# EAGLE schematic sensing (EAGLE 7.4.0)
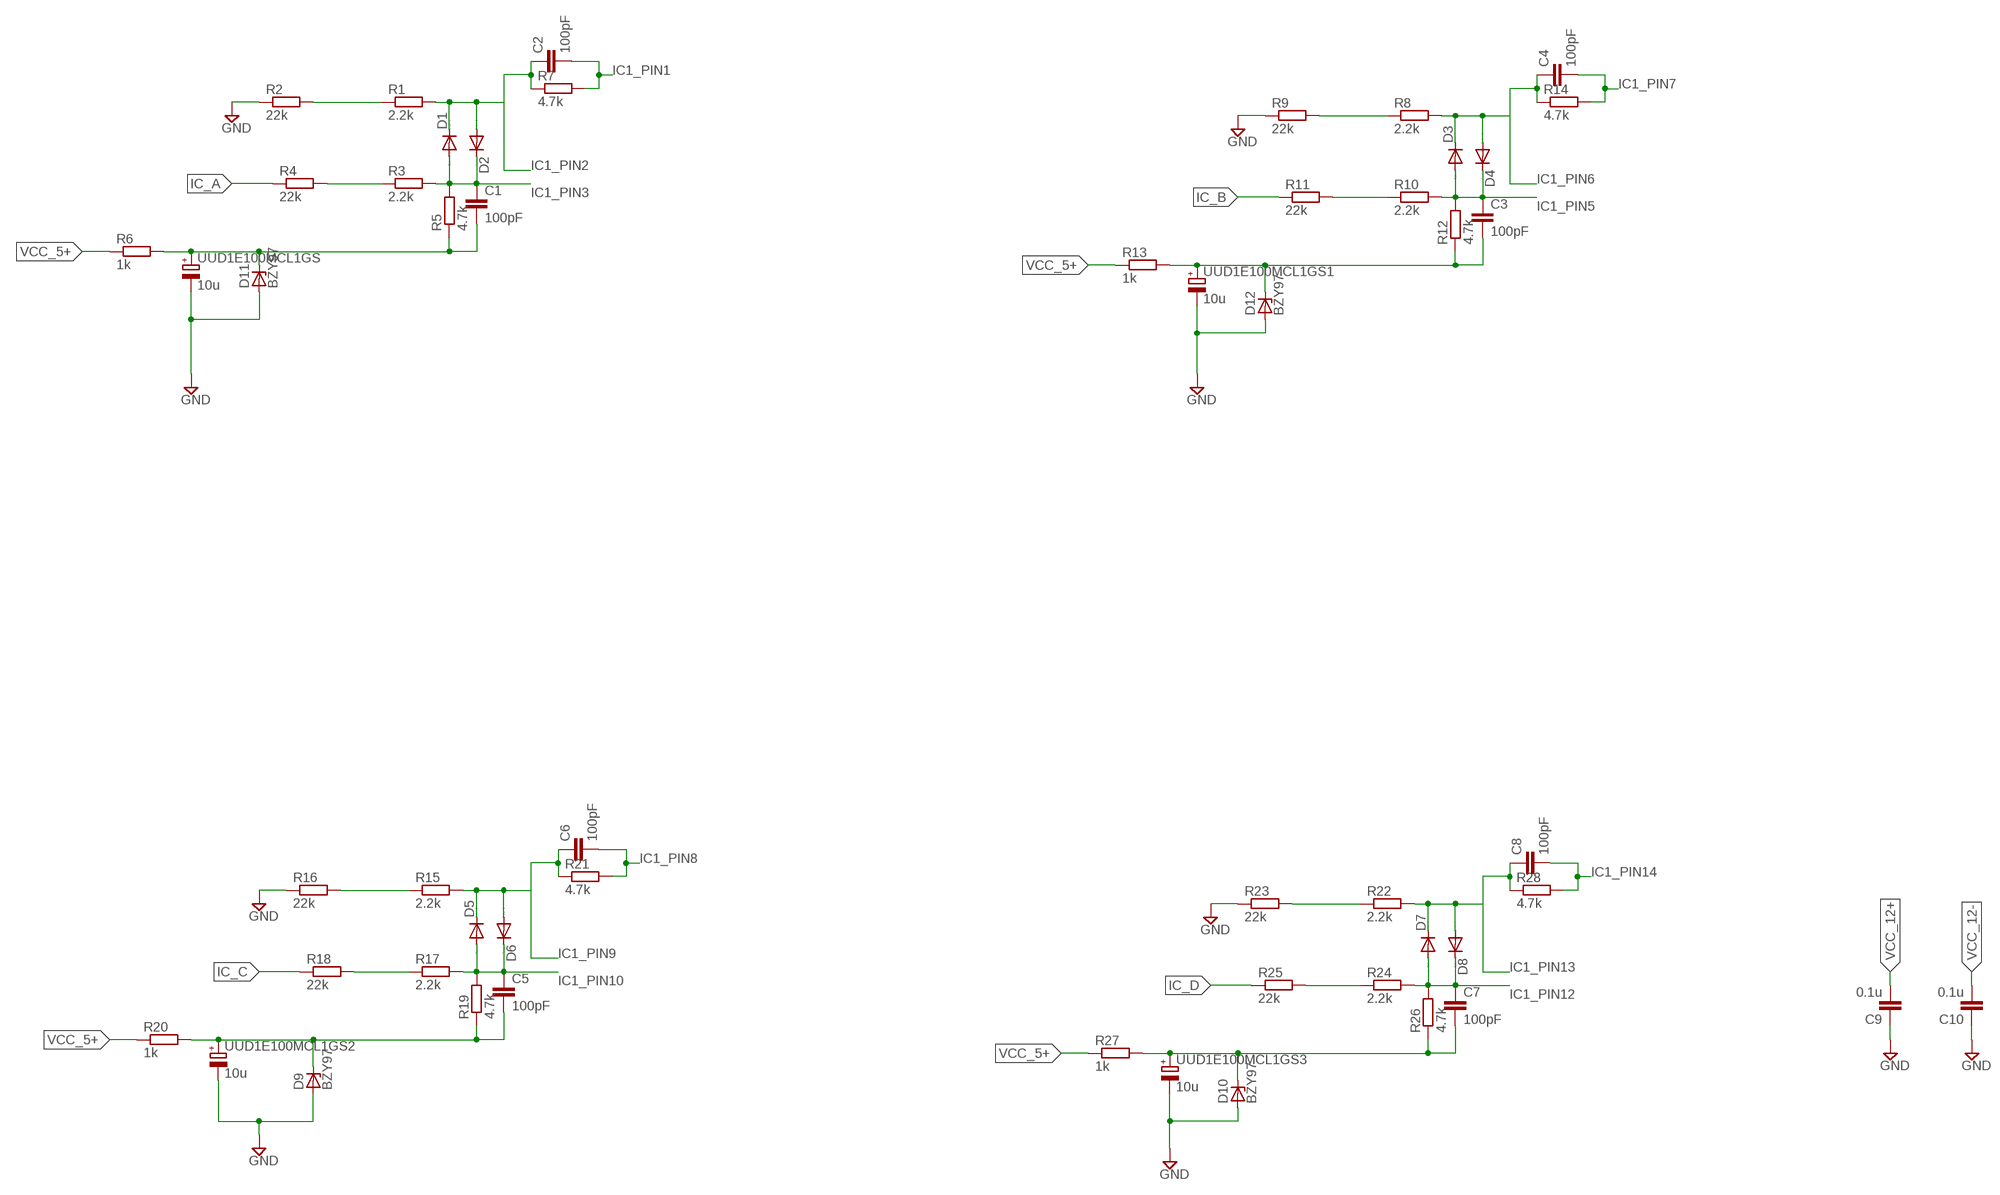
[diagram p0: schematic, sheet 1, part 1 of 3]
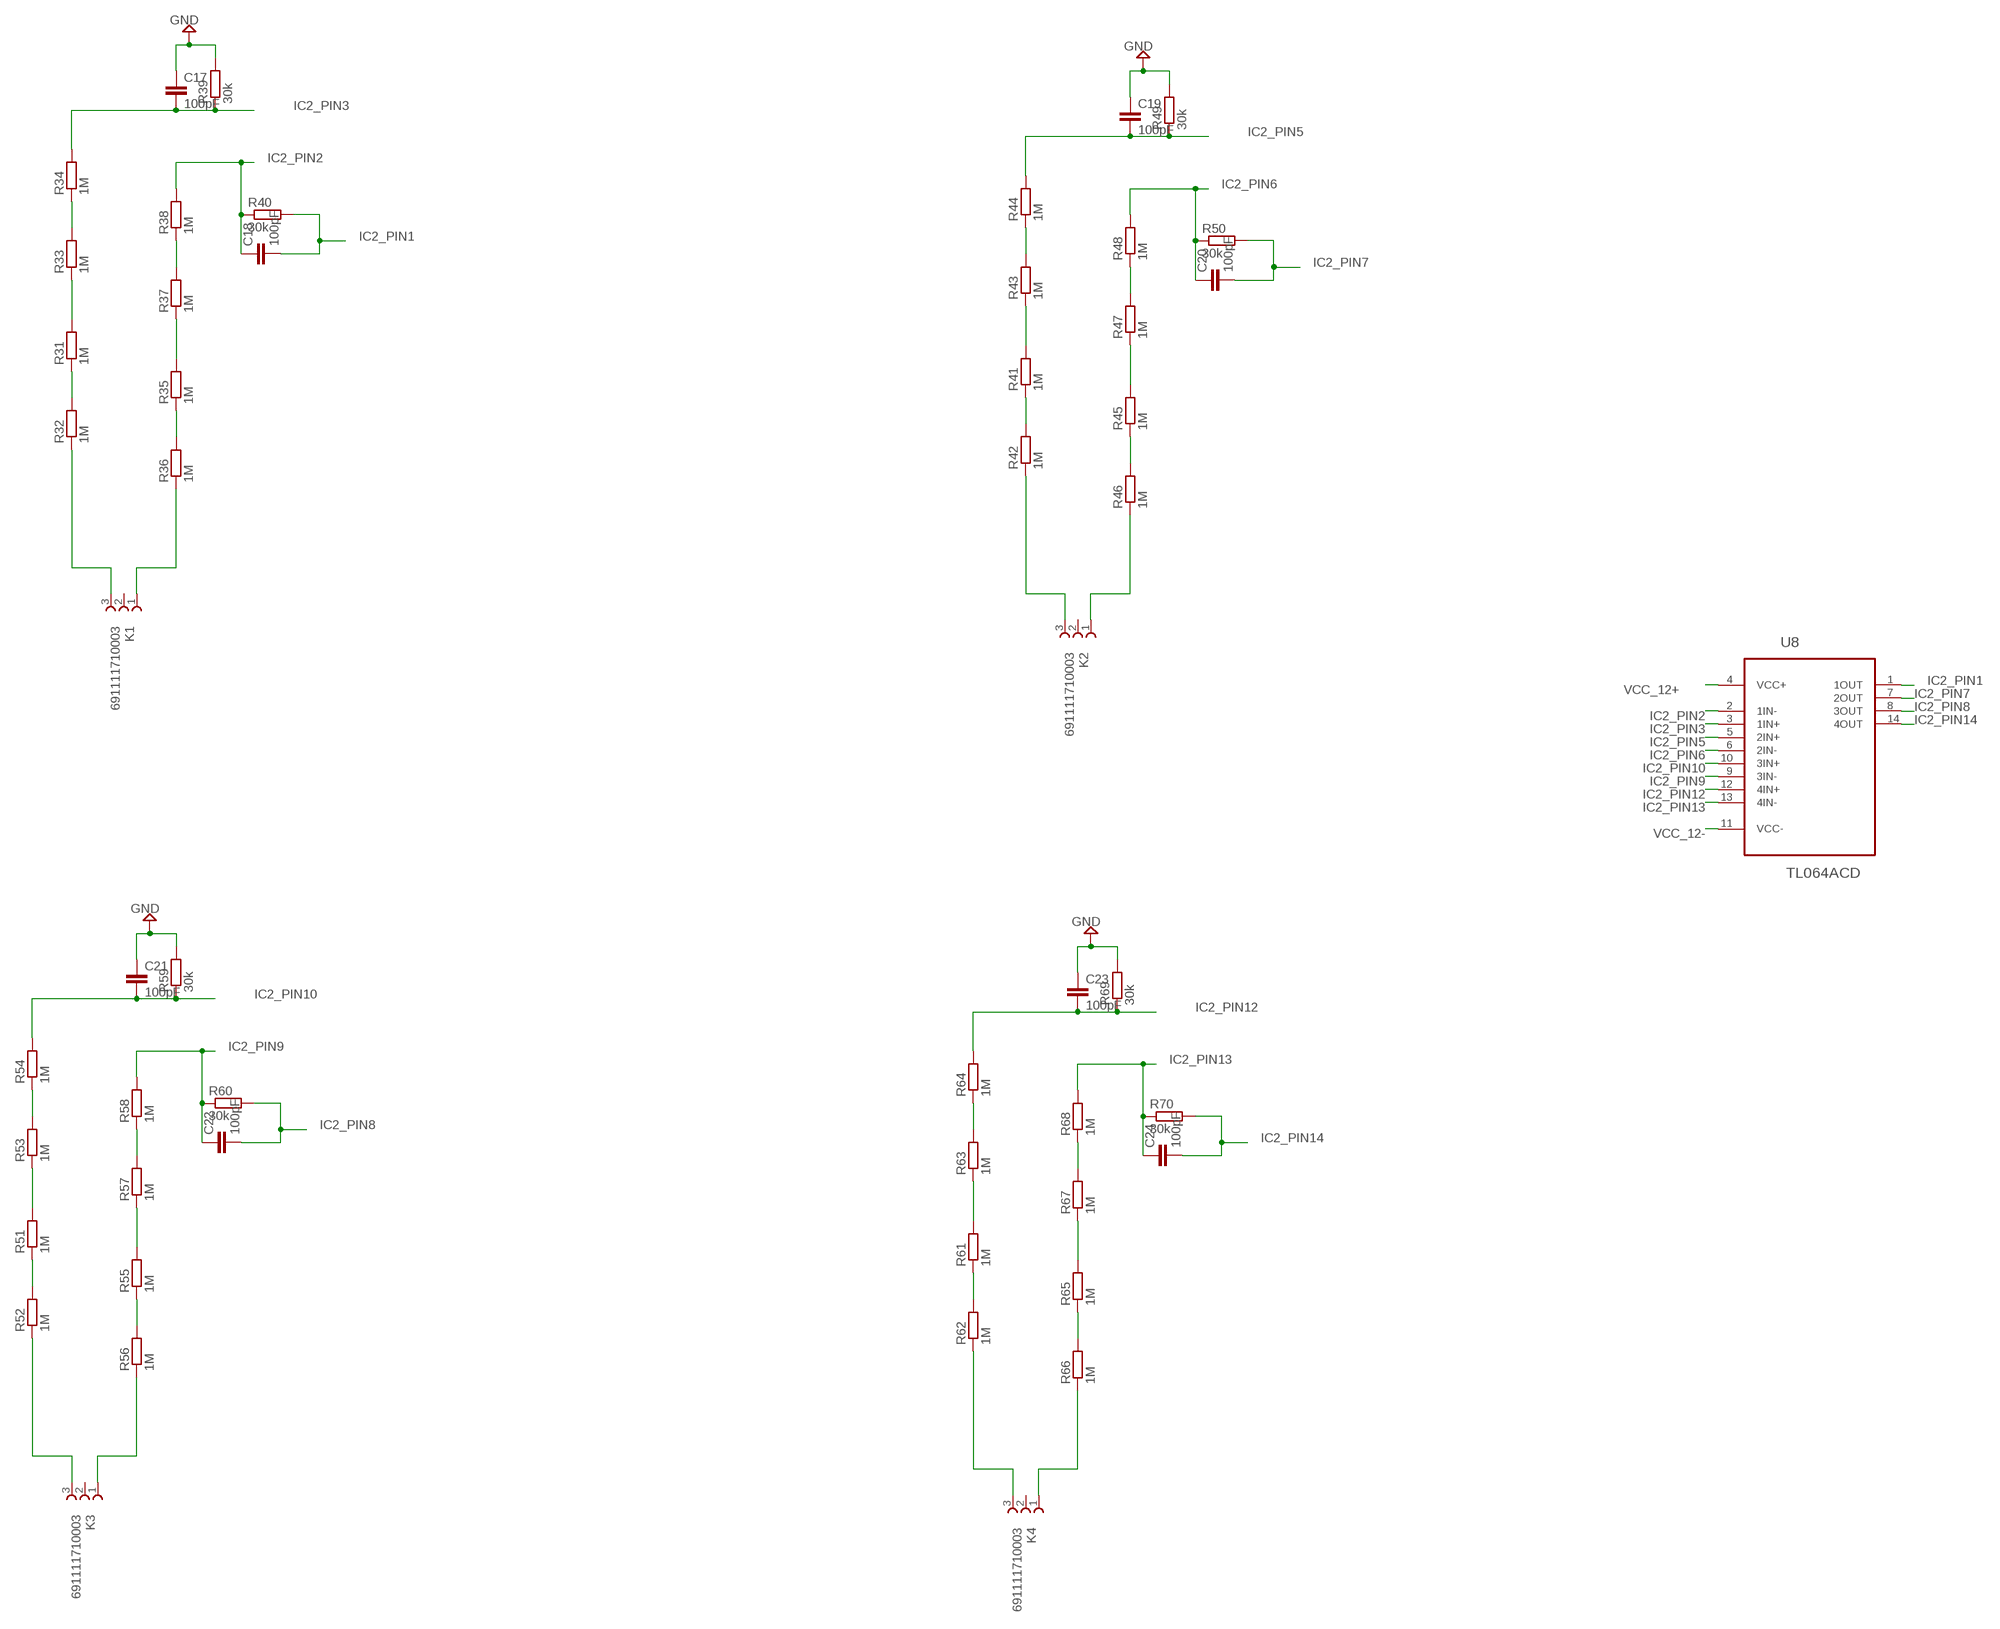
[diagram p1: schematic, sheet 1, part 2 of 3]
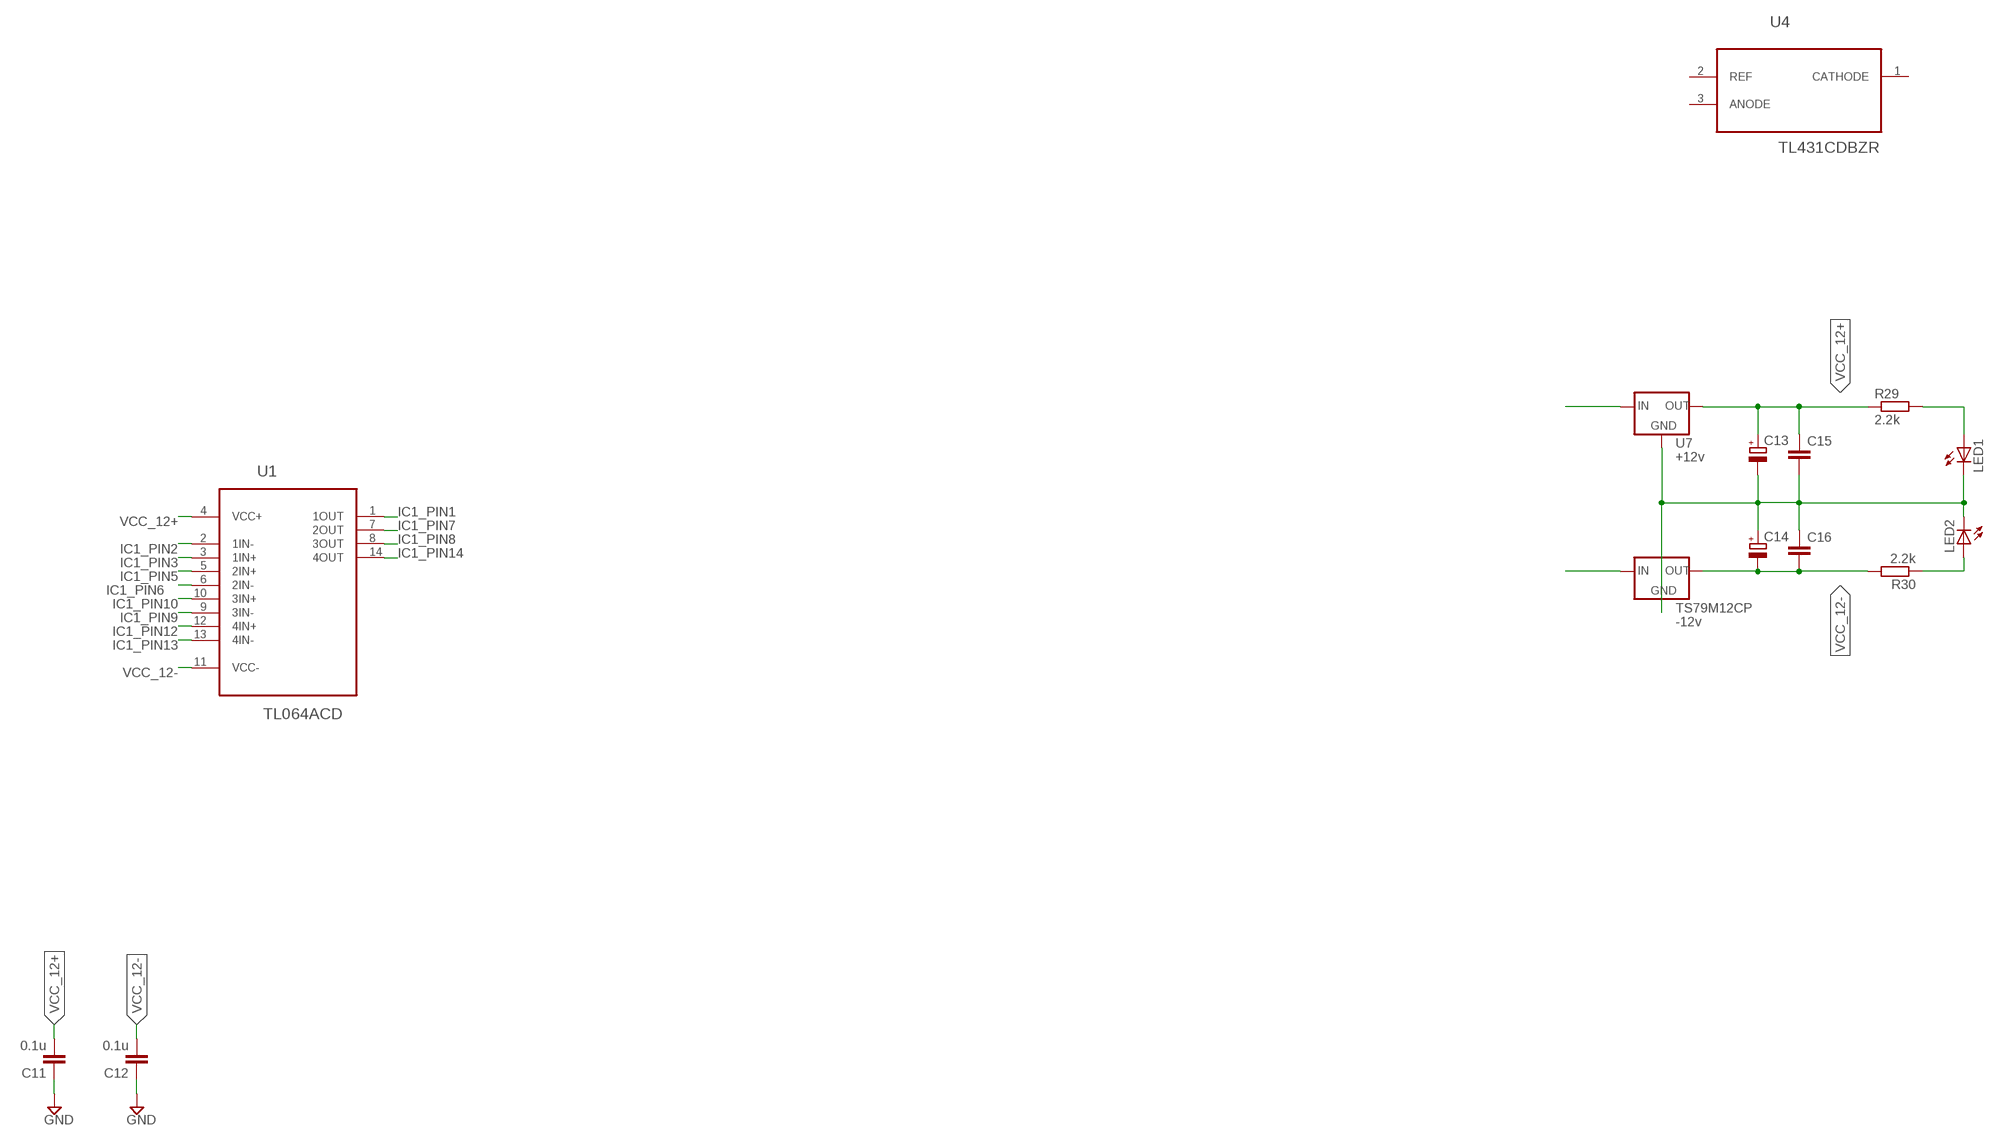
[diagram p2: schematic, sheet 1, part 3 of 3]

## Parts
C1  100pF  C-EUC0402K  [C0402K]
C2  100pF  C-EUC0402K  [C0402K]
C3  100pF  C-EUC0402K  [C0402K]
C4  100pF  C-EUC0402K  [C0402K]
C5  100pF  C-EUC0402K  [C0402K]
C6  100pF  C-EUC0402K  [C0402K]
C7  100pF  C-EUC0402K  [C0402K]
C8  100pF  C-EUC0402K  [C0402K]
C9  0.1u  C-EUC0603K  [C0603K]
C10  0.1u  C-EUC0603K  [C0603K]
C11  0.1u  C-EUC0603K  [C0603K]
C12  0.1u  C-EUC0603K  [C0603K]
C13  CPOL-EU150CLZ-1014  [150CLZ-1014]
C14  CPOL-EU150CLZ-1014  [150CLZ-1014]
C15  C-EUC1206  [C1206]
C16  C-EUC1206  [C1206]
C17  100pF  C-EUC0402K  [C0402K]
C18  100pF  C-EUC0402K  [C0402K]
C19  100pF  C-EUC0402K  [C0402K]
C20  100pF  C-EUC0402K  [C0402K]
C21  100pF  C-EUC0402K  [C0402K]
C22  100pF  C-EUC0402K  [C0402K]
C23  100pF  C-EUC0402K  [C0402K]
C24  100pF  C-EUC0402K  [C0402K]
D1  DIODE-DO41-10  [DO41-10]
D2  DIODE-DO41-10  [DO41-10]
D3  DIODE-DO41-10  [DO41-10]
D4  DIODE-DO41-10  [DO41-10]
D5  DIODE-DO41-10  [DO41-10]
D6  DIODE-DO41-10  [DO41-10]
D7  DIODE-DO41-10  [DO41-10]
D8  DIODE-DO41-10  [DO41-10]
D9  BZY97  [F126Z12]
D10  BZY97  [F126Z12]
D11  BZY97  [F126Z12]
D12  BZY97  [F126Z12]
K1  691111710003  [691111710003]
K2  691111710003  [691111710003]
K3  691111710003  [691111710003]
K4  691111710003  [691111710003]
LED1  LED3MM  [LED3MM]
LED2  LED3MM  [LED3MM]
R1  2.2k  R-EU_0207/10  [0207/10]
R2  22k  R-EU_0207/10  [0207/10]
R3  2.2k  R-EU_0207/10  [0207/10]
R4  22k  R-EU_0207/10  [0207/10]
R5  4.7k  R-EU_0207/10  [0207/10]
R6  1k  R-EU_0207/10  [0207/10]
R7  4.7k  R-EU_0207/10  [0207/10]
R8  2.2k  R-EU_0207/10  [0207/10]
R9  22k  R-EU_0207/10  [0207/10]
R10  2.2k  R-EU_0207/10  [0207/10]
R11  22k  R-EU_0207/10  [0207/10]
R12  4.7k  R-EU_0207/10  [0207/10]
R13  1k  R-EU_0207/10  [0207/10]
R14  4.7k  R-EU_0207/10  [0207/10]
R15  2.2k  R-EU_0207/10  [0207/10]
R16  22k  R-EU_0207/10  [0207/10]
R17  2.2k  R-EU_0207/10  [0207/10]
R18  22k  R-EU_0207/10  [0207/10]
R19  4.7k  R-EU_0207/10  [0207/10]
R20  1k  R-EU_0207/10  [0207/10]
R21  4.7k  R-EU_0207/10  [0207/10]
R22  2.2k  R-EU_0207/10  [0207/10]
R23  22k  R-EU_0207/10  [0207/10]
R24  2.2k  R-EU_0207/10  [0207/10]
R25  22k  R-EU_0207/10  [0207/10]
R26  4.7k  R-EU_0207/10  [0207/10]
R27  1k  R-EU_0207/10  [0207/10]
R28  4.7k  R-EU_0207/10  [0207/10]
R29  2.2k  R-EU_0207/10  [0207/10]
R30  2.2k  R-EU_0207/10  [0207/10]
R31  1M  R-EU_0207/10  [0207/10]
R32  1M  R-EU_0207/10  [0207/10]
R33  1M  R-EU_0207/12  [0207/12]
R34  1M  R-EU_0207/10  [0207/10]
R35  1M  R-EU_0207/10  [0207/10]
R36  1M  R-EU_0207/10  [0207/10]
R37  1M  R-EU_0207/10  [0207/10]
R38  1M  R-EU_0207/10  [0207/10]
R39  30k  R-EU_0207/10  [0207/10]
R40  30k  R-EU_0207/10  [0207/10]
R41  1M  R-EU_0207/10  [0207/10]
R42  1M  R-EU_0207/10  [0207/10]
R43  1M  R-EU_0207/10  [0207/10]
R44  1M  R-EU_0207/10  [0207/10]
R45  1M  R-EU_0207/10  [0207/10]
R46  1M  R-EU_0207/10  [0207/10]
R47  1M  R-EU_0207/10  [0207/10]
R48  1M  R-EU_0207/10  [0207/10]
R49  30k  R-EU_0207/10  [0207/10]
R50  30k  R-EU_0207/10  [0207/10]
R51  1M  R-EU_0207/10  [0207/10]
R52  1M  R-EU_0207/10  [0207/10]
R53  1M  R-EU_0207/10  [0207/10]
R54  1M  R-EU_0207/10  [0207/10]
R55  1M  R-EU_0207/10  [0207/10]
R56  1M  R-EU_0207/10  [0207/10]
R57  1M  R-EU_0207/10  [0207/10]
R58  1M  R-EU_0207/10  [0207/10]
R59  30k  R-EU_0207/10  [0207/10]
R60  30k  R-EU_0207/10  [0207/10]
R61  1M  R-EU_0207/10  [0207/10]
R62  1M  R-EU_0207/10  [0207/10]
R63  1M  R-EU_0207/10  [0207/10]
R64  1M  R-EU_0207/10  [0207/10]
R65  1M  R-EU_0207/10  [0207/10]
R66  1M  R-EU_0207/10  [0207/10]
R67  1M  R-EU_0207/10  [0207/10]
R68  1M  R-EU_0207/10  [0207/10]
R69  30k  R-EU_0207/10  [0207/10]
R70  30k  R-EU_0207/10  [0207/10]
TS79M12CP  -12v  V_REG_78XX7912  [TO-252]
U1  TL064ACD  [SOIC127P600X175-14N]
U4  TL431CDBZR  [SOT95P237X112-3N]
U7  +12v  V_REG_78XX7812  [TO-252]
U8  TL064ACD  [SOIC127P600X175-14N]
UUD1E100MCL1GS  10u  CPOL-EU153CLV-0405  [153CLV-0405]
UUD1E100MCL1GS1  10u  CPOL-EU153CLV-0405  [153CLV-0405]
UUD1E100MCL1GS2  10u  CPOL-EU153CLV-0405  [153CLV-0405]
UUD1E100MCL1GS3  10u  CPOL-EU153CLV-0405  [153CLV-0405]

## Nets
GND: C9.1 C10.1 C11.1 C12.1 C17.1 C19.1 C21.1 C23.1 D9.A D10.A D11.A D12.A R2.1 R9.1 R16.1 R23.1 R39.2 R49.2 R59.2 R69.2 UUD1E100MCL1GS1.- UUD1E100MCL1GS2.- UUD1E100MCL1GS3.- UUD1E100MCL1GS.-
IC1_PIN1: C2.2 R7.2 U1.1(1OUT)
IC1_PIN2: C2.1 D1.C D2.A R1.2 R7.1 U1.2(1IN-)
IC1_PIN3: C1.1 D1.A D2.C R3.2 R5.2 U1.3(1IN+)
IC1_PIN5: C3.1 D3.A D4.C R10.2 R12.2 U1.5(2IN+)
IC1_PIN6: C4.1 D3.C D4.A R8.2 R14.1 U1.6(2IN-)
IC1_PIN7: C4.2 R14.2 U1.7(2OUT)
IC1_PIN8: C6.2 R21.2 U1.8(3OUT)
IC1_PIN9: C6.1 D5.C D6.A R15.2 R21.1 U1.9(3IN-)
IC1_PIN10: C5.1 D5.A D6.C R17.2 R19.2 U1.10(3IN+)
IC1_PIN12: C7.1 D7.A D8.C R24.2 R26.2 U1.12(4IN+)
IC1_PIN13: C8.1 D7.C D8.A R22.2 R28.1 U1.13(4IN-)
IC1_PIN14: C8.2 R28.2 U1.14(4OUT)
IC2_PIN1: C18.2 R40.2 U8.1(1OUT)
IC2_PIN2: C18.1 R38.2 R40.1 U8.2(1IN-)
IC2_PIN3: C17.2 R34.2 R39.1 U8.3(1IN+)
IC2_PIN5: C19.2 R44.2 R49.1 U8.5(2IN+)
IC2_PIN6: C20.1 R48.2 R50.1 U8.6(2IN-)
IC2_PIN7: C20.2 R50.2 U8.7(2OUT)
IC2_PIN8: C22.2 R60.2 U8.8(3OUT)
IC2_PIN9: C22.1 R58.2 R60.1 U8.9(3IN-)
IC2_PIN10: C21.2 R54.2 R59.1 U8.10(3IN+)
IC2_PIN12: C23.2 R64.2 R69.1 U8.12(4IN+)
IC2_PIN13: C24.1 R68.2 R70.1 U8.13(4IN-)
IC2_PIN14: C24.2 R70.2 U8.14(4OUT)
IC_A: R4.1
IC_B: R11.1
IC_C: R18.1
IC_D: R25.1
N$1: R33.2 R34.1
N$2: R1.1 R2.2
N$3: R3.1 R4.2
N$4: R8.1 R9.2
N$5: R10.1 R11.2
N$6: C1.2 D11.C R5.1 R6.2 UUD1E100MCL1GS.+
N$7: R15.1 R16.2
N$8: R17.1 R18.2
N$9: C5.2 D9.C R19.1 R20.2 UUD1E100MCL1GS2.+
N$10: C13.- C14.+ TS79M12CP.1(GND) U7.3(GND)
N$11: R22.1 R23.2
N$12: R24.1 R25.2
N$13: C3.2 D12.C R12.1 R13.2 UUD1E100MCL1GS1.+
N$14: C7.2 D10.C R26.1 R27.2 UUD1E100MCL1GS3.+
N$15: R31.2 R33.1
N$16: LED1.A R29.2
N$17: TS79M12CP.2(IN)
N$18: U7.1(IN)
N$19: C15.2 C16.1 LED1.K(C) LED2.K(C)
N$20: LED2.A R30.1
N$21: R31.1 R32.2
N$22: R37.2 R38.1
N$23: R35.2 R37.1
N$24: R35.1 R36.2
N$25: K1.3 R32.1
N$26: K1.1 R36.1
N$27: R41.2 R43.1
N$28: R41.1 R42.2
N$29: R47.2 R48.1
N$30: R45.2 R47.1
N$31: R45.1 R46.2
N$32: R43.2 R44.1
N$33: K2.3 R42.1
N$34: K2.1 R46.1
N$35: R51.2 R53.1
N$36: R51.1 R52.2
N$37: R57.2 R58.1
N$38: R55.2 R57.1
N$39: R55.1 R56.2
N$40: R53.2 R54.1
N$41: K3.3 R52.1
N$42: K3.1 R56.1
N$43: R61.2 R63.1
N$44: R61.1 R62.2
N$45: R67.2 R68.1
N$46: R65.2 R67.1
N$47: R65.1 R66.2
N$48: R63.2 R64.1
N$49: K4.3 R62.1
N$50: K4.1 R66.1
VCC_5+: R6.1 R13.1 R20.1 R27.1
VCC_12+: C9.2 C11.2 C13.+ C15.1 R29.1 U1.4(VCC+) U7.2(OUT) U8.4(VCC+)
VCC_12-: C10.2 C12.2 C14.- C16.2 R30.2 TS79M12CP.3(OUT) U1.11(VCC-) U8.11(VCC-)
Unconnected: K1.2 K2.2 K3.2 K4.2 U4.1(CATHODE) U4.3(ANODE)

## Power pins joined to a net without a drawn wire
REF: U4.2(REF)

## Library data of the parts
C1-C12 C15-C24 = rcl:C-EU: CAPACITOR, European symbol
C13 C14 UUD1E100MCL1GS UUD1E100MCL1GS1-UUD1E100MCL1GS3 = rcl:CPOL-EU: POLARIZED CAPACITOR, European symbol
D1-D8 = diode:DIODE-: DIODE
D9-D12 = diode:BZY97: Z DIODE
K1-K4 = Wurth_Elektronik_Electromechanic_Terminal_Blocks_Connectors_rev15d:691111710003: WR-TBL Serie 111 - 5.0mm Horizontal Entry Modular With Pressure Clamp - 2.0mm2 Wires, 3 Pins=>Code : Con_TBL_Screw_PressureClamp_691111710003 <http://katalog.we-online.de/media/images/eican/Con_TBL_Screw_PressureClamp_6911117100xx_pf2.jpg> Details see: http://katalog.we-online.de/en/em/691_111_710_0xx Created 2014-06-17, Karrer Zheng 2014 (C) Würth Elektronik
LED1 LED2 = led:LED: LED OSRAM: - CHIPLED LG R971, LG N971, LY N971, LG Q971, LY Q971, LO R971, LY R971 LH N974, LH R974 LS Q976, LO Q976, LY Q976 LO Q996 - Hyper CHIPLED LW Q18S LB Q993, LB Q99A, LB R99A - SideLED LS A670, LO A670, LY A670, LG A670, LP A670 LB A673, LV A673, LT A673, LW A673 LH A674 LY A675 LS A676, LA A676, LO A676, LY A676, LW A676 LS A679, LY A679, LG A679 - Hyper Micro SIDELED® LS Y876, LA Y876, LO Y876, LY Y876 LT Y87S - SmartLED LW L88C, LW L88S LB L89C, LB L89S, LG L890 LS L89K, LO L89K, LY L89K LS L896, LA L896, LO L896, LY L896 - TOPLED LS T670, LO T670, LY T670, LG T670, LP T670 LSG T670, LSP T670, LSY T670, LOP T670, LYG T670 LG T671, LOG T671, LSG T671 LB T673, LV T673, LT T673, LW T673 LH T674 LS T676, LA T676, LO T676, LY T676, LB T676, LH T676, LSB T676, LW T676 LB T67C, LV T67C, LT T67C, LS T67K, LO T67K, LY T67K, LW E67C LS E67B, LA E67B, LO E67B, LY E67B, LB E67C, LV E67C, LT E67C LW T67C LS T679, LY T679, LG T679 LS T770, LO T770, LY T770, LG T770, LP T770 LB T773, LV T773, LT T773, LW T773 LH T774 LS E675, LA E675, LY E675, LS T675 LS T776, LA T776, LO T776, LY T776, LB T776 LHGB T686 LT T68C, LB T68C - Hyper Mini TOPLED® LB M676 - Mini TOPLED Santana® LG M470 LS M47K, LO M47K, LY M47K Source: http://www.osram.convergy.de LUXEON: - LUMILED® LXK2-PW12-R00, LXK2-PW12-S00, LXK2-PW14-U00, LXK2-PW14-V00 LXK2-PM12-R00, LXK2-PM12-S00, LXK2-PM14-U00 LXK2-PE12-Q00, LXK2-PE12-R00, LXK2-PE12-S00, LXK2-PE14-T00, LXK2-PE14-U00 LXK2-PB12-K00, LXK2-PB12-L00, LXK2-PB12-M00, LXK2-PB14-N00, LXK2-PB14-P00, LXK2-PB14-Q00 LXK2-PR12-L00, LXK2-PR12-M00, LXK2-PR14-Q00, LXK2-PR14-R00 LXK2-PD12-Q00, LXK2-PD12-R00, LXK2-PD12-S00 LXK2-PH12-R00, LXK2-PH12-S00 LXK2-PL12-P00, LXK2-PL12-Q00, LXK2-PL12-R00 Source: www.luxeon.com KINGBRIGHT: KA-3528ASYC Source: www.kingbright.com
R1-R70 = rcl:R-EU_: RESISTOR, European symbol
TS79M12CP = rathin_lib:V_REG_78XX: Voltage Regulator Standard 78xx regulator. IGO (Input Ground Output). Spark Fun Electronics SKU : COM-00107; PROD_ID: VREG-12370; VALUE: +12v
U1 U8 = Texas Instruments_By_element14_Batch_1:TL064ACD: OPERATION AMPLIFIERS; MPN: TL064ACD; OC_FARNELL: 9593276; OC_NEWARK: 08F9237; PACKAGE: SOIC-14; SUPPLIER: Texas Instruments
U4 = Texas Instruments_By_element14_Batch_1:TL431CDBZR: PRECISION PROGRAMMABLE REFERENCE; MPN: TL431CDBZR; OC_FARNELL: 1716917; OC_NEWARK: 44J2408; PACKAGE: SOT23-3; SUPPLIER: Texas Instruments
U7 = SparkFun-PowerIC:V_REG_78XX: Voltage Regulator Standard 78xx regulator. IGO (Input Ground Output). Spark Fun Electronics SKU : COM-00107; PROD_ID: VREG-12370